# Altium schematic sheet 12_FPGA_banks_3A_3B_4A.SchDoc: FPGA banks 3A, 3B, 4A
size A3; Organization: Lime Microsystems; Address1: Surrey Tech Centre; Address2: Guildford GU2 7YG; Address3: Surrey; Address4: United Kingdom; Revision: v1.2; SheetNumber: 10; SheetTotal: 27
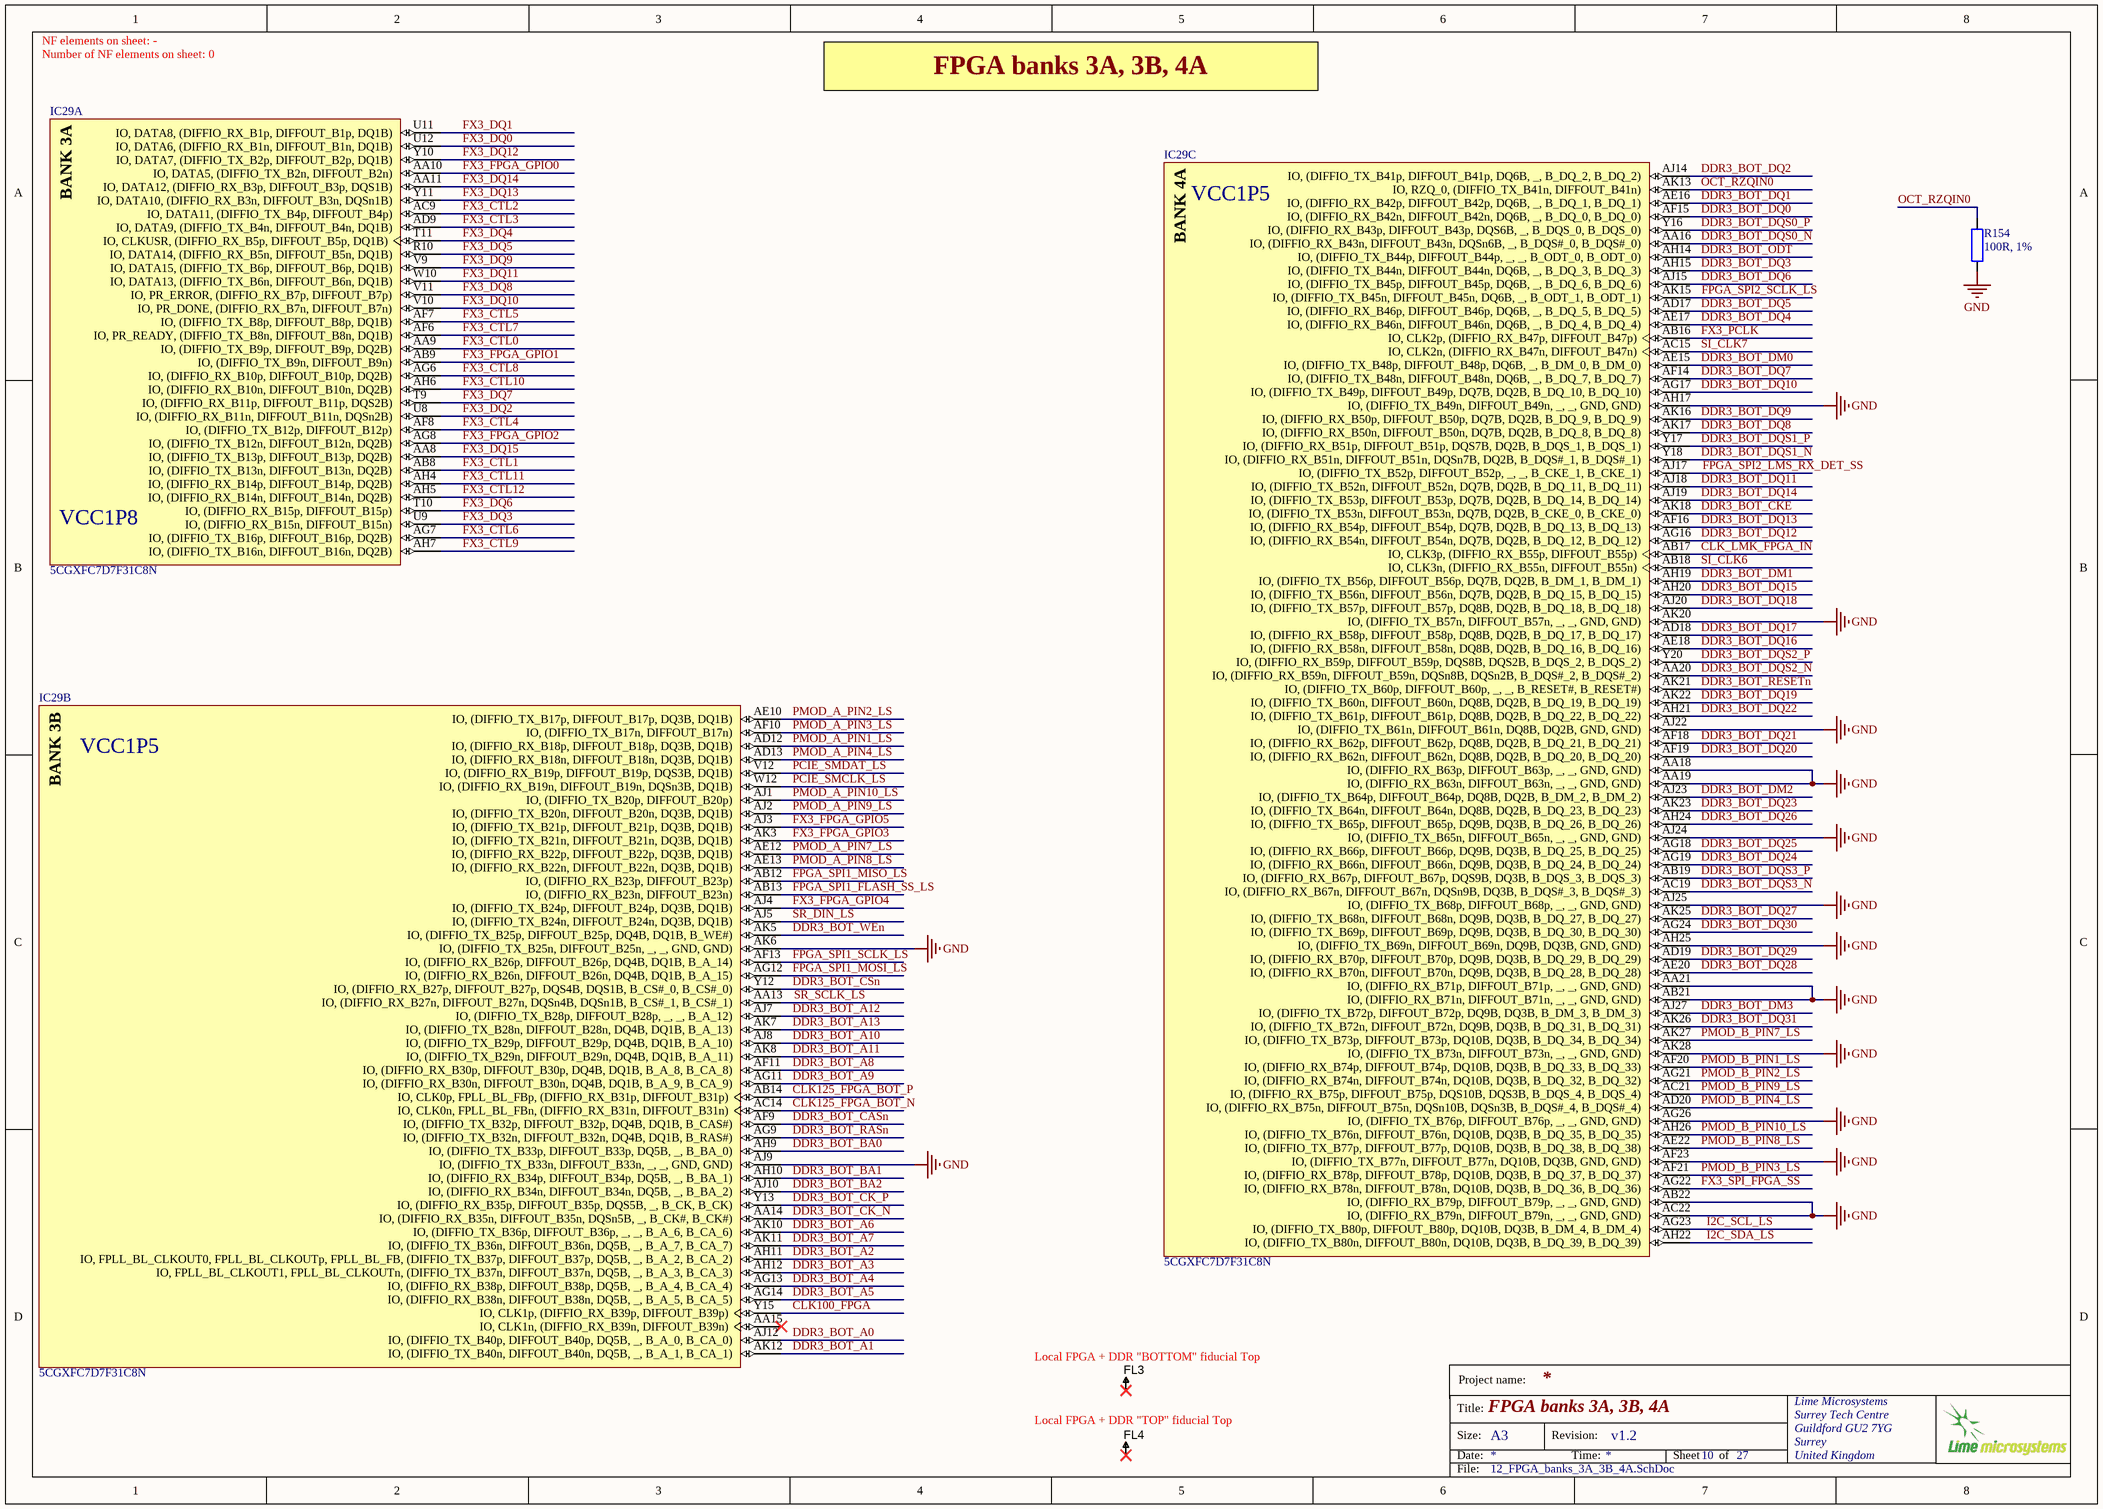
[diagram p0: 12_FPGA_banks_3A_3B_4A.SchDoc]

## Parts
FL3  Fiducial  [Fiducial_local]  (value not drawn)
FL4  Fiducial  [Fiducial_local]  (value not drawn)
IC29  5CGXFC7D7F31C8N  [ALTR-FBGA896_A-200]  (parts A,B,C of 16)
R154  100R, 1%  [RES0402]

## Nets
GND: IC29.AA18(IO,_(DIFFIO_RX_B63p,_DIFFOUT_B63p,__,__,_GND,_GND)) IC29.AA19(IO,_(DIFFIO_RX_B63n,_DIFFOUT_B63n,__,__,_GND,_GND)) IC29.AA21(IO,_(DIFFIO_RX_B71p,_DIFFOUT_B71p,__,__,_GND,_GND)) IC29.AB21(IO,_(DIFFIO_RX_B71n,_DIFFOUT_B71n,__,__,_GND,_GND)) IC29.AB22(IO,_(DIFFIO_RX_B79p,_DIFFOUT_B79p,__,__,_GND,_GND)) IC29.AC22(IO,_(DIFFIO_RX_B79n,_DIFFOUT_B79n,__,__,_GND,_GND)) IC29.AF23(IO,_(DIFFIO_TX_B77n,_DIFFOUT_B77n,_DQ10B,_DQ3B,_GND,_GND)) IC29.AG26(IO,_(DIFFIO_TX_B76p,_DIFFOUT_B76p,__,__,_GND,_GND)) IC29.AH17(IO,_(DIFFIO_TX_B49n,_DIFFOUT_B49n,__,__,_GND,_GND)) IC29.AH25(IO,_(DIFFIO_TX_B69n,_DIFFOUT_B69n,_DQ9B,_DQ3B,_GND,_GND)) IC29.AJ9(IO,_(DIFFIO_TX_B33n,_DIFFOUT_B33n,__,__,_GND,_GND)) IC29.AJ22(IO,_(DIFFIO_TX_B61n,_DIFFOUT_B61n,_DQ8B,_DQ2B,_GND,_GND)) IC29.AJ24(IO,_(DIFFIO_TX_B65n,_DIFFOUT_B65n,__,__,_GND,_GND)) IC29.AJ25(IO,_(DIFFIO_TX_B68p,_DIFFOUT_B68p,__,__,_GND,_GND)) IC29.AK6(IO,_(DIFFIO_TX_B25n,_DIFFOUT_B25n,__,__,_GND,_GND)) IC29.AK20(IO,_(DIFFIO_TX_B57n,_DIFFOUT_B57n,__,__,_GND,_GND)) IC29.AK28(IO,_(DIFFIO_TX_B73n,_DIFFOUT_B73n,__,__,_GND,_GND)) R154.1
CLK100_FPGA: IC29.Y15(IO,_CLK1p,_(DIFFIO_RX_B39p,_DIFFOUT_B39p))
CLK125_FPGA_BOT_N: IC29.AC14(IO,_CLK0n,_FPLL_BL_FBn,_(DIFFIO_RX_B31n,_DIFFOUT_B31n))
CLK125_FPGA_BOT_P: IC29.AB14(IO,_CLK0p,_FPLL_BL_FBp,_(DIFFIO_RX_B31p,_DIFFOUT_B31p))
CLK_LMK_FPGA_IN: IC29.AB17(IO,_CLK3p,_(DIFFIO_RX_B55p,_DIFFOUT_B55p))
DDR3_BOT_A0: IC29.AJ12(IO,_(DIFFIO_TX_B40p,_DIFFOUT_B40p,_DQ5B,__,_B_A_0,_B_CA_0))
DDR3_BOT_A1: IC29.AK12(IO,_(DIFFIO_TX_B40n,_DIFFOUT_B40n,_DQ5B,__,_B_A_1,_B_CA_1))
DDR3_BOT_A2: IC29.AH11(IO,_FPLL_BL_CLKOUT0,_FPLL_BL_CLKOUTp,_FPLL_BL_FB,_(DIFFIO_TX_B37p,_DIFFOUT_B37p,_DQ5B,__,_B_A_2,_B_CA_2))
DDR3_BOT_A3: IC29.AH12(IO,_FPLL_BL_CLKOUT1,_FPLL_BL_CLKOUTn,_(DIFFIO_TX_B37n,_DIFFOUT_B37n,_DQ5B,__,_B_A_3,_B_CA_3))
DDR3_BOT_A4: IC29.AG13(IO,_(DIFFIO_RX_B38p,_DIFFOUT_B38p,_DQ5B,__,_B_A_4,_B_CA_4))
DDR3_BOT_A5: IC29.AG14(IO,_(DIFFIO_RX_B38n,_DIFFOUT_B38n,_DQ5B,__,_B_A_5,_B_CA_5))
DDR3_BOT_A6: IC29.AK10(IO,_(DIFFIO_TX_B36p,_DIFFOUT_B36p,__,__,_B_A_6,_B_CA_6))
DDR3_BOT_A7: IC29.AK11(IO,_(DIFFIO_TX_B36n,_DIFFOUT_B36n,_DQ5B,__,_B_A_7,_B_CA_7))
DDR3_BOT_A8: IC29.AF11(IO,_(DIFFIO_RX_B30p,_DIFFOUT_B30p,_DQ4B,_DQ1B,_B_A_8,_B_CA_8))
DDR3_BOT_A9: IC29.AG11(IO,_(DIFFIO_RX_B30n,_DIFFOUT_B30n,_DQ4B,_DQ1B,_B_A_9,_B_CA_9))
DDR3_BOT_A10: IC29.AJ8(IO,_(DIFFIO_TX_B29p,_DIFFOUT_B29p,_DQ4B,_DQ1B,_B_A_10))
DDR3_BOT_A11: IC29.AK8(IO,_(DIFFIO_TX_B29n,_DIFFOUT_B29n,_DQ4B,_DQ1B,_B_A_11))
DDR3_BOT_A12: IC29.AJ7(IO,_(DIFFIO_TX_B28p,_DIFFOUT_B28p,__,__,_B_A_12))
DDR3_BOT_A13: IC29.AK7(IO,_(DIFFIO_TX_B28n,_DIFFOUT_B28n,_DQ4B,_DQ1B,_B_A_13))
DDR3_BOT_BA0: IC29.AH9(IO,_(DIFFIO_TX_B33p,_DIFFOUT_B33p,_DQ5B,__,_B_BA_0))
DDR3_BOT_BA1: IC29.AH10(IO,_(DIFFIO_RX_B34p,_DIFFOUT_B34p,_DQ5B,__,_B_BA_1))
DDR3_BOT_BA2: IC29.AJ10(IO,_(DIFFIO_RX_B34n,_DIFFOUT_B34n,_DQ5B,__,_B_BA_2))
DDR3_BOT_CASn: IC29.AF9(IO,_(DIFFIO_TX_B32p,_DIFFOUT_B32p,_DQ4B,_DQ1B,_B_CAS#))
DDR3_BOT_CK_N: IC29.AA14(IO,_(DIFFIO_RX_B35n,_DIFFOUT_B35n,_DQSn5B,__,_B_CK#,_B_CK#))
DDR3_BOT_CK_P: IC29.Y13(IO,_(DIFFIO_RX_B35p,_DIFFOUT_B35p,_DQS5B,__,_B_CK,_B_CK))
DDR3_BOT_CKE: IC29.AK18(IO,_(DIFFIO_TX_B53n,_DIFFOUT_B53n,_DQ7B,_DQ2B,_B_CKE_0,_B_CKE_0))
DDR3_BOT_CSn: IC29.Y12(IO,_(DIFFIO_RX_B27p,_DIFFOUT_B27p,_DQS4B,_DQS1B,_B_CS#_0,_B_CS#_0))
DDR3_BOT_DM0: IC29.AE15(IO,_(DIFFIO_TX_B48p,_DIFFOUT_B48p,_DQ6B,__,_B_DM_0,_B_DM_0))
DDR3_BOT_DM1: IC29.AH19(IO,_(DIFFIO_TX_B56p,_DIFFOUT_B56p,_DQ7B,_DQ2B,_B_DM_1,_B_DM_1))
DDR3_BOT_DM2: IC29.AJ23(IO,_(DIFFIO_TX_B64p,_DIFFOUT_B64p,_DQ8B,_DQ2B,_B_DM_2,_B_DM_2))
DDR3_BOT_DM3: IC29.AJ27(IO,_(DIFFIO_TX_B72p,_DIFFOUT_B72p,_DQ9B,_DQ3B,_B_DM_3,_B_DM_3))
DDR3_BOT_DQ0: IC29.AF15(IO,_(DIFFIO_RX_B42n,_DIFFOUT_B42n,_DQ6B,__,_B_DQ_0,_B_DQ_0))
DDR3_BOT_DQ1: IC29.AE16(IO,_(DIFFIO_RX_B42p,_DIFFOUT_B42p,_DQ6B,__,_B_DQ_1,_B_DQ_1))
DDR3_BOT_DQ2: IC29.AJ14(IO,_(DIFFIO_TX_B41p,_DIFFOUT_B41p,_DQ6B,__,_B_DQ_2,_B_DQ_2))
DDR3_BOT_DQ3: IC29.AH15(IO,_(DIFFIO_TX_B44n,_DIFFOUT_B44n,_DQ6B,__,_B_DQ_3,_B_DQ_3))
DDR3_BOT_DQ4: IC29.AE17(IO,_(DIFFIO_RX_B46n,_DIFFOUT_B46n,_DQ6B,__,_B_DQ_4,_B_DQ_4))
DDR3_BOT_DQ5: IC29.AD17(IO,_(DIFFIO_RX_B46p,_DIFFOUT_B46p,_DQ6B,__,_B_DQ_5,_B_DQ_5))
DDR3_BOT_DQ6: IC29.AJ15(IO,_(DIFFIO_TX_B45p,_DIFFOUT_B45p,_DQ6B,__,_B_DQ_6,_B_DQ_6))
DDR3_BOT_DQ7: IC29.AF14(IO,_(DIFFIO_TX_B48n,_DIFFOUT_B48n,_DQ6B,__,_B_DQ_7,_B_DQ_7))
DDR3_BOT_DQ8: IC29.AK17(IO,_(DIFFIO_RX_B50n,_DIFFOUT_B50n,_DQ7B,_DQ2B,_B_DQ_8,_B_DQ_8))
DDR3_BOT_DQ9: IC29.AK16(IO,_(DIFFIO_RX_B50p,_DIFFOUT_B50p,_DQ7B,_DQ2B,_B_DQ_9,_B_DQ_9))
DDR3_BOT_DQ10: IC29.AG17(IO,_(DIFFIO_TX_B49p,_DIFFOUT_B49p,_DQ7B,_DQ2B,_B_DQ_10,_B_DQ_10))
DDR3_BOT_DQ11: IC29.AJ18(IO,_(DIFFIO_TX_B52n,_DIFFOUT_B52n,_DQ7B,_DQ2B,_B_DQ_11,_B_DQ_11))
DDR3_BOT_DQ12: IC29.AG16(IO,_(DIFFIO_RX_B54n,_DIFFOUT_B54n,_DQ7B,_DQ2B,_B_DQ_12,_B_DQ_12))
DDR3_BOT_DQ13: IC29.AF16(IO,_(DIFFIO_RX_B54p,_DIFFOUT_B54p,_DQ7B,_DQ2B,_B_DQ_13,_B_DQ_13))
DDR3_BOT_DQ14: IC29.AJ19(IO,_(DIFFIO_TX_B53p,_DIFFOUT_B53p,_DQ7B,_DQ2B,_B_DQ_14,_B_DQ_14))
DDR3_BOT_DQ15: IC29.AH20(IO,_(DIFFIO_TX_B56n,_DIFFOUT_B56n,_DQ7B,_DQ2B,_B_DQ_15,_B_DQ_15))
DDR3_BOT_DQ16: IC29.AE18(IO,_(DIFFIO_RX_B58n,_DIFFOUT_B58n,_DQ8B,_DQ2B,_B_DQ_16,_B_DQ_16))
DDR3_BOT_DQ17: IC29.AD18(IO,_(DIFFIO_RX_B58p,_DIFFOUT_B58p,_DQ8B,_DQ2B,_B_DQ_17,_B_DQ_17))
DDR3_BOT_DQ18: IC29.AJ20(IO,_(DIFFIO_TX_B57p,_DIFFOUT_B57p,_DQ8B,_DQ2B,_B_DQ_18,_B_DQ_18))
DDR3_BOT_DQ19: IC29.AK22(IO,_(DIFFIO_TX_B60n,_DIFFOUT_B60n,_DQ8B,_DQ2B,_B_DQ_19,_B_DQ_19))
DDR3_BOT_DQ20: IC29.AF19(IO,_(DIFFIO_RX_B62n,_DIFFOUT_B62n,_DQ8B,_DQ2B,_B_DQ_20,_B_DQ_20))
DDR3_BOT_DQ21: IC29.AF18(IO,_(DIFFIO_RX_B62p,_DIFFOUT_B62p,_DQ8B,_DQ2B,_B_DQ_21,_B_DQ_21))
DDR3_BOT_DQ22: IC29.AH21(IO,_(DIFFIO_TX_B61p,_DIFFOUT_B61p,_DQ8B,_DQ2B,_B_DQ_22,_B_DQ_22))
DDR3_BOT_DQ23: IC29.AK23(IO,_(DIFFIO_TX_B64n,_DIFFOUT_B64n,_DQ8B,_DQ2B,_B_DQ_23,_B_DQ_23))
DDR3_BOT_DQ24: IC29.AG19(IO,_(DIFFIO_RX_B66n,_DIFFOUT_B66n,_DQ9B,_DQ3B,_B_DQ_24,_B_DQ_24))
DDR3_BOT_DQ25: IC29.AG18(IO,_(DIFFIO_RX_B66p,_DIFFOUT_B66p,_DQ9B,_DQ3B,_B_DQ_25,_B_DQ_25))
DDR3_BOT_DQ26: IC29.AH24(IO,_(DIFFIO_TX_B65p,_DIFFOUT_B65p,_DQ9B,_DQ3B,_B_DQ_26,_B_DQ_26))
DDR3_BOT_DQ27: IC29.AK25(IO,_(DIFFIO_TX_B68n,_DIFFOUT_B68n,_DQ9B,_DQ3B,_B_DQ_27,_B_DQ_27))
DDR3_BOT_DQ28: IC29.AE20(IO,_(DIFFIO_RX_B70n,_DIFFOUT_B70n,_DQ9B,_DQ3B,_B_DQ_28,_B_DQ_28))
DDR3_BOT_DQ29: IC29.AD19(IO,_(DIFFIO_RX_B70p,_DIFFOUT_B70p,_DQ9B,_DQ3B,_B_DQ_29,_B_DQ_29))
DDR3_BOT_DQ30: IC29.AG24(IO,_(DIFFIO_TX_B69p,_DIFFOUT_B69p,_DQ9B,_DQ3B,_B_DQ_30,_B_DQ_30))
DDR3_BOT_DQ31: IC29.AK26(IO,_(DIFFIO_TX_B72n,_DIFFOUT_B72n,_DQ9B,_DQ3B,_B_DQ_31,_B_DQ_31))
DDR3_BOT_DQS0_N: IC29.AA16(IO,_(DIFFIO_RX_B43n,_DIFFOUT_B43n,_DQSn6B,__,_B_DQS#_0,_B_DQS#_0))
DDR3_BOT_DQS0_P: IC29.Y16(IO,_(DIFFIO_RX_B43p,_DIFFOUT_B43p,_DQS6B,__,_B_DQS_0,_B_DQS_0))
DDR3_BOT_DQS1_N: IC29.Y18(IO,_(DIFFIO_RX_B51n,_DIFFOUT_B51n,_DQSn7B,_DQ2B,_B_DQS#_1,_B_DQS#_1))
DDR3_BOT_DQS1_P: IC29.Y17(IO,_(DIFFIO_RX_B51p,_DIFFOUT_B51p,_DQS7B,_DQ2B,_B_DQS_1,_B_DQS_1))
DDR3_BOT_DQS2_N: IC29.AA20(IO,_(DIFFIO_RX_B59n,_DIFFOUT_B59n,_DQSn8B,_DQSn2B,_B_DQS#_2,_B_DQS#_2))
DDR3_BOT_DQS2_P: IC29.Y20(IO,_(DIFFIO_RX_B59p,_DIFFOUT_B59p,_DQS8B,_DQS2B,_B_DQS_2,_B_DQS_2))
DDR3_BOT_DQS3_N: IC29.AC19(IO,_(DIFFIO_RX_B67n,_DIFFOUT_B67n,_DQSn9B,_DQ3B,_B_DQS#_3,_B_DQS#_3))
DDR3_BOT_DQS3_P: IC29.AB19(IO,_(DIFFIO_RX_B67p,_DIFFOUT_B67p,_DQS9B,_DQ3B,_B_DQS_3,_B_DQS_3))
DDR3_BOT_ODT: IC29.AH14(IO,_(DIFFIO_TX_B44p,_DIFFOUT_B44p,__,__,_B_ODT_0,_B_ODT_0))
DDR3_BOT_RASn: IC29.AG9(IO,_(DIFFIO_TX_B32n,_DIFFOUT_B32n,_DQ4B,_DQ1B,_B_RAS#))
DDR3_BOT_RESETn: IC29.AK21(IO,_(DIFFIO_TX_B60p,_DIFFOUT_B60p,__,__,_B_RESET#,_B_RESET#))
DDR3_BOT_WEn: IC29.AK5(IO,_(DIFFIO_TX_B25p,_DIFFOUT_B25p,_DQ4B,_DQ1B,_B_WE#))
FPGA_SPI1_FLASH_SS_LS: IC29.AB13(IO,_(DIFFIO_RX_B23n,_DIFFOUT_B23n))
FPGA_SPI1_MISO_LS: IC29.AB12(IO,_(DIFFIO_RX_B23p,_DIFFOUT_B23p))
FPGA_SPI1_MOSI_LS: IC29.AG12(IO,_(DIFFIO_RX_B26n,_DIFFOUT_B26n,_DQ4B,_DQ1B,_B_A_15))
FPGA_SPI1_SCLK_LS: IC29.AF13(IO,_(DIFFIO_RX_B26p,_DIFFOUT_B26p,_DQ4B,_DQ1B,_B_A_14))
FPGA_SPI2_LMS_RX_DET_SS: IC29.AJ17(IO,_(DIFFIO_TX_B52p,_DIFFOUT_B52p,__,__,_B_CKE_1,_B_CKE_1))
FPGA_SPI2_SCLK_LS: IC29.AK15(IO,_(DIFFIO_TX_B45n,_DIFFOUT_B45n,_DQ6B,__,_B_ODT_1,_B_ODT_1))
FX3_CTL0: IC29.AA9(IO,_(DIFFIO_TX_B9p,_DIFFOUT_B9p,_DQ2B))
FX3_CTL1: IC29.AB8(IO,_(DIFFIO_TX_B13n,_DIFFOUT_B13n,_DQ2B))
FX3_CTL2: IC29.AC9(IO,_DATA11,_(DIFFIO_TX_B4p,_DIFFOUT_B4p))
FX3_CTL3: IC29.AD9(IO,_DATA9,_(DIFFIO_TX_B4n,_DIFFOUT_B4n,_DQ1B))
FX3_CTL4: IC29.AF8(IO,_(DIFFIO_TX_B12p,_DIFFOUT_B12p))
FX3_CTL5: IC29.AF7(IO,_(DIFFIO_TX_B8p,_DIFFOUT_B8p,_DQ1B))
FX3_CTL6: IC29.AG7(IO,_(DIFFIO_TX_B16p,_DIFFOUT_B16p,_DQ2B))
FX3_CTL7: IC29.AF6(IO,_PR_READY,_(DIFFIO_TX_B8n,_DIFFOUT_B8n,_DQ1B))
FX3_CTL8: IC29.AG6(IO,_(DIFFIO_RX_B10p,_DIFFOUT_B10p,_DQ2B))
FX3_CTL9: IC29.AH7(IO,_(DIFFIO_TX_B16n,_DIFFOUT_B16n,_DQ2B))
FX3_CTL10: IC29.AH6(IO,_(DIFFIO_RX_B10n,_DIFFOUT_B10n,_DQ2B))
FX3_CTL11: IC29.AH4(IO,_(DIFFIO_RX_B14p,_DIFFOUT_B14p,_DQ2B))
FX3_CTL12: IC29.AH5(IO,_(DIFFIO_RX_B14n,_DIFFOUT_B14n,_DQ2B))
FX3_DQ0: IC29.U12(IO,_DATA6,_(DIFFIO_RX_B1n,_DIFFOUT_B1n,_DQ1B))
FX3_DQ1: IC29.U11(IO,_DATA8,_(DIFFIO_RX_B1p,_DIFFOUT_B1p,_DQ1B))
FX3_DQ2: IC29.U8(IO,_(DIFFIO_RX_B11n,_DIFFOUT_B11n,_DQSn2B))
FX3_DQ3: IC29.U9(IO,_(DIFFIO_RX_B15n,_DIFFOUT_B15n))
FX3_DQ4: IC29.T11(IO,_CLKUSR,_(DIFFIO_RX_B5p,_DIFFOUT_B5p,_DQ1B))
FX3_DQ5: IC29.R10(IO,_DATA14,_(DIFFIO_RX_B5n,_DIFFOUT_B5n,_DQ1B))
FX3_DQ6: IC29.T10(IO,_(DIFFIO_RX_B15p,_DIFFOUT_B15p))
FX3_DQ7: IC29.T9(IO,_(DIFFIO_RX_B11p,_DIFFOUT_B11p,_DQS2B))
FX3_DQ8: IC29.V11(IO,_PR_ERROR,_(DIFFIO_RX_B7p,_DIFFOUT_B7p))
FX3_DQ9: IC29.V9(IO,_DATA15,_(DIFFIO_TX_B6p,_DIFFOUT_B6p,_DQ1B))
FX3_DQ10: IC29.V10(IO,_PR_DONE,_(DIFFIO_RX_B7n,_DIFFOUT_B7n))
FX3_DQ11: IC29.W10(IO,_DATA13,_(DIFFIO_TX_B6n,_DIFFOUT_B6n,_DQ1B))
FX3_DQ12: IC29.Y10(IO,_DATA7,_(DIFFIO_TX_B2p,_DIFFOUT_B2p,_DQ1B))
FX3_DQ13: IC29.Y11(IO,_DATA10,_(DIFFIO_RX_B3n,_DIFFOUT_B3n,_DQSn1B))
FX3_DQ14: IC29.AA11(IO,_DATA12,_(DIFFIO_RX_B3p,_DIFFOUT_B3p,_DQS1B))
FX3_DQ15: IC29.AA8(IO,_(DIFFIO_TX_B13p,_DIFFOUT_B13p,_DQ2B))
FX3_FPGA_GPIO0: IC29.AA10(IO,_DATA5,_(DIFFIO_TX_B2n,_DIFFOUT_B2n))
FX3_FPGA_GPIO1: IC29.AB9(IO,_(DIFFIO_TX_B9n,_DIFFOUT_B9n))
FX3_FPGA_GPIO2: IC29.AG8(IO,_(DIFFIO_TX_B12n,_DIFFOUT_B12n,_DQ2B))
FX3_FPGA_GPIO3: IC29.AK3(IO,_(DIFFIO_TX_B21n,_DIFFOUT_B21n,_DQ3B,_DQ1B))
FX3_FPGA_GPIO4: IC29.AJ4(IO,_(DIFFIO_TX_B24p,_DIFFOUT_B24p,_DQ3B,_DQ1B))
FX3_FPGA_GPIO5: IC29.AJ3(IO,_(DIFFIO_TX_B21p,_DIFFOUT_B21p,_DQ3B,_DQ1B))
FX3_PCLK: IC29.AB16(IO,_CLK2p,_(DIFFIO_RX_B47p,_DIFFOUT_B47p))
FX3_SPI_FPGA_SS: IC29.AG22(IO,_(DIFFIO_RX_B78n,_DIFFOUT_B78n,_DQ10B,_DQ3B,_B_DQ_36,_B_DQ_36))
I2C_SCL_LS: IC29.AG23(IO,_(DIFFIO_TX_B80p,_DIFFOUT_B80p,_DQ10B,_DQ3B,_B_DM_4,_B_DM_4))
I2C_SDA_LS: IC29.AH22(IO,_(DIFFIO_TX_B80n,_DIFFOUT_B80n,_DQ10B,_DQ3B,_B_DQ_39,_B_DQ_39))
OCT_RZQIN0: IC29.AK13(IO,_RZQ_0,_(DIFFIO_TX_B41n,_DIFFOUT_B41n)) R154.2
PCIE_SMCLK_LS: IC29.W12(IO,_(DIFFIO_RX_B19n,_DIFFOUT_B19n,_DQSn3B,_DQ1B))
PCIE_SMDAT_LS: IC29.V12(IO,_(DIFFIO_RX_B19p,_DIFFOUT_B19p,_DQS3B,_DQ1B))
PMOD_A_PIN1_LS: IC29.AD12(IO,_(DIFFIO_RX_B18p,_DIFFOUT_B18p,_DQ3B,_DQ1B))
PMOD_A_PIN2_LS: IC29.AE10(IO,_(DIFFIO_TX_B17p,_DIFFOUT_B17p,_DQ3B,_DQ1B))
PMOD_A_PIN3_LS: IC29.AF10(IO,_(DIFFIO_TX_B17n,_DIFFOUT_B17n))
PMOD_A_PIN4_LS: IC29.AD13(IO,_(DIFFIO_RX_B18n,_DIFFOUT_B18n,_DQ3B,_DQ1B))
PMOD_A_PIN7_LS: IC29.AE12(IO,_(DIFFIO_RX_B22p,_DIFFOUT_B22p,_DQ3B,_DQ1B))
PMOD_A_PIN8_LS: IC29.AE13(IO,_(DIFFIO_RX_B22n,_DIFFOUT_B22n,_DQ3B,_DQ1B))
PMOD_A_PIN9_LS: IC29.AJ2(IO,_(DIFFIO_TX_B20n,_DIFFOUT_B20n,_DQ3B,_DQ1B))
PMOD_A_PIN10_LS: IC29.AJ1(IO,_(DIFFIO_TX_B20p,_DIFFOUT_B20p))
PMOD_B_PIN1_LS: IC29.AF20(IO,_(DIFFIO_RX_B74p,_DIFFOUT_B74p,_DQ10B,_DQ3B,_B_DQ_33,_B_DQ_33))
PMOD_B_PIN2_LS: IC29.AG21(IO,_(DIFFIO_RX_B74n,_DIFFOUT_B74n,_DQ10B,_DQ3B,_B_DQ_32,_B_DQ_32))
PMOD_B_PIN3_LS: IC29.AF21(IO,_(DIFFIO_RX_B78p,_DIFFOUT_B78p,_DQ10B,_DQ3B,_B_DQ_37,_B_DQ_37))
PMOD_B_PIN4_LS: IC29.AD20(IO,_(DIFFIO_RX_B75n,_DIFFOUT_B75n,_DQSn10B,_DQSn3B,_B_DQS#_4,_B_DQS#_4))
PMOD_B_PIN7_LS: IC29.AK27(IO,_(DIFFIO_TX_B73p,_DIFFOUT_B73p,_DQ10B,_DQ3B,_B_DQ_34,_B_DQ_34))
PMOD_B_PIN8_LS: IC29.AE22(IO,_(DIFFIO_TX_B77p,_DIFFOUT_B77p,_DQ10B,_DQ3B,_B_DQ_38,_B_DQ_38))
PMOD_B_PIN9_LS: IC29.AC21(IO,_(DIFFIO_RX_B75p,_DIFFOUT_B75p,_DQS10B,_DQS3B,_B_DQS_4,_B_DQS_4))
PMOD_B_PIN10_LS: IC29.AH26(IO,_(DIFFIO_TX_B76n,_DIFFOUT_B76n,_DQ10B,_DQ3B,_B_DQ_35,_B_DQ_35))
SI_CLK6: IC29.AB18(IO,_CLK3n,_(DIFFIO_RX_B55n,_DIFFOUT_B55n))
SI_CLK7: IC29.AC15(IO,_CLK2n,_(DIFFIO_RX_B47n,_DIFFOUT_B47n))
SR_DIN_LS: IC29.AJ5(IO,_(DIFFIO_TX_B24n,_DIFFOUT_B24n,_DQ3B,_DQ1B))
SR_SCLK_LS: IC29.AA13(IO,_(DIFFIO_RX_B27n,_DIFFOUT_B27n,_DQSn4B,_DQSn1B,_B_CS#_1,_B_CS#_1))

Not connected (* = marked no-connect by the designer): FL3 1*; FL4 1*; IC29 AA15(IO,_CLK1n,_(DIFFIO_RX_B39n,_DIFFOUT_B39n))*

## Notes on the sheet
- NF elements on sheet: -
- Number of NF elements on sheet: 0
- FPGA banks 3A, 3B, 4A
- VCC1P5
- VCC1P8
- (near FL3) Local FPGA + DDR "BOTTOM" fiducial Top
- (near FL4) Local FPGA + DDR "TOP" fiducial Top
- Project name:
- Title:
- Size:
- Date:
- A3
- Revision:
- Time:
- Sheet
- of
- File:
- (in symbol 5CGXFC7D7F31C8N, part A) BANK 3A
- (in symbol 5CGXFC7D7F31C8N, part B) BANK 3B
- (in symbol 5CGXFC7D7F31C8N, part C) BANK 4A

## Library data of the parts
IC29 = 5CGXFC7D7F31C8N: Cyclone V GX Family FPGA, 1.07 to 1.13 V Supply, 480 I/O Pins, 7 PLLs, 896-Pin FBGA, Speed Grade 8, Commercial Grade, RoHS Compliant; Manufacturer: Altera; Part Description: IC FPGA 480 I/O 896FBGA; GPIO: 480; Logic Elements (LE) (K): 149.5; Speed Grade: 8; DatasheetVersion: Rev. 3.4; PackageVersion: Rev. 2.0, 12/2012; PackageReference: FBGA896_A-200; PackageDescription: 896-Pin FineLine Ball-Grid Array (FBGA), Body 31 x 31 mm, Pitch 1 mm; Supplier 1: Digi-Key; Supplier Part Number 1: 544-2772-ND; Supplier 2: Mouser; Supplier Part Number 2: 989-5CGXFC7D7F31C8N; Device Group: 5CGXFC7; RoHS: RoHS Compliant; Subcategory: Cyclone V GX; Voltage Supply: 1.07 to 1.13 V; NexusDeviceID: 5CGXFC7D7F31C8N; Mounting Technology: Surface Mount; Code_JEDEC: MS-034-AAN-1; PartNumber: 5CGXFC7D7F31C8N; ComponentLink1Description: Manufacturer URL; ComponentLink1URL: http://www.altera.com; ComponentLink2Description: Datasheet; ComponentLink2URL: http://www.altera.com/literature/hb/cyclone-v/cv_51002.pdf; ComponentLink3Description: Package Specification; ComponentLink3URL: http://www.altera.com/devicepackaging/04R00435-01.pdf; ComponentLink4Description: Device Handbook URL; ComponentLink4URL: http://www.altera.com/literature/hb/cyclone-v/cyclone5_handbook.pdf; ComponentLink5Description: Device Pin-Out URL; ComponentLink5URL: http://www.altera.com/literature/dp/cyclone-v/5CGXFC7.xls; ComponentLink6Description: Device Overview URL; ComponentLink6URL: http://www.altera.com/literature/hb/cyclone-v/cv_51001.pdf; ComponentLink7Description: Product URL; ComponentLink7URL: http://www.buyaltera.com/scripts/partsearch.dll?Detail&name=5CGXFC7D7F31C8N-ND
R154 = Res_0402: Manufacturer Part Number 1: RMCF0402FT100R; Part Description: RES SMD 100 OHM 1% 1/16W 0402; Manufacturer: Stackpole Electronics Inc.; Temperature Coefficient: ±100ppm/°C; Supplier 1: Digi-Key; Supplier Part Number 1: RMCF0402FT100RDKR-ND; Package / Case: 0402 (1005 Metric); Composition: Thick Film; Category: Resistors; Tolerance: ±1%; Value: 100R, 1%